# Altium schematic sheet MiniScreen.SchDoc
size D; SheetNumber: 1; SheetTotal: 1
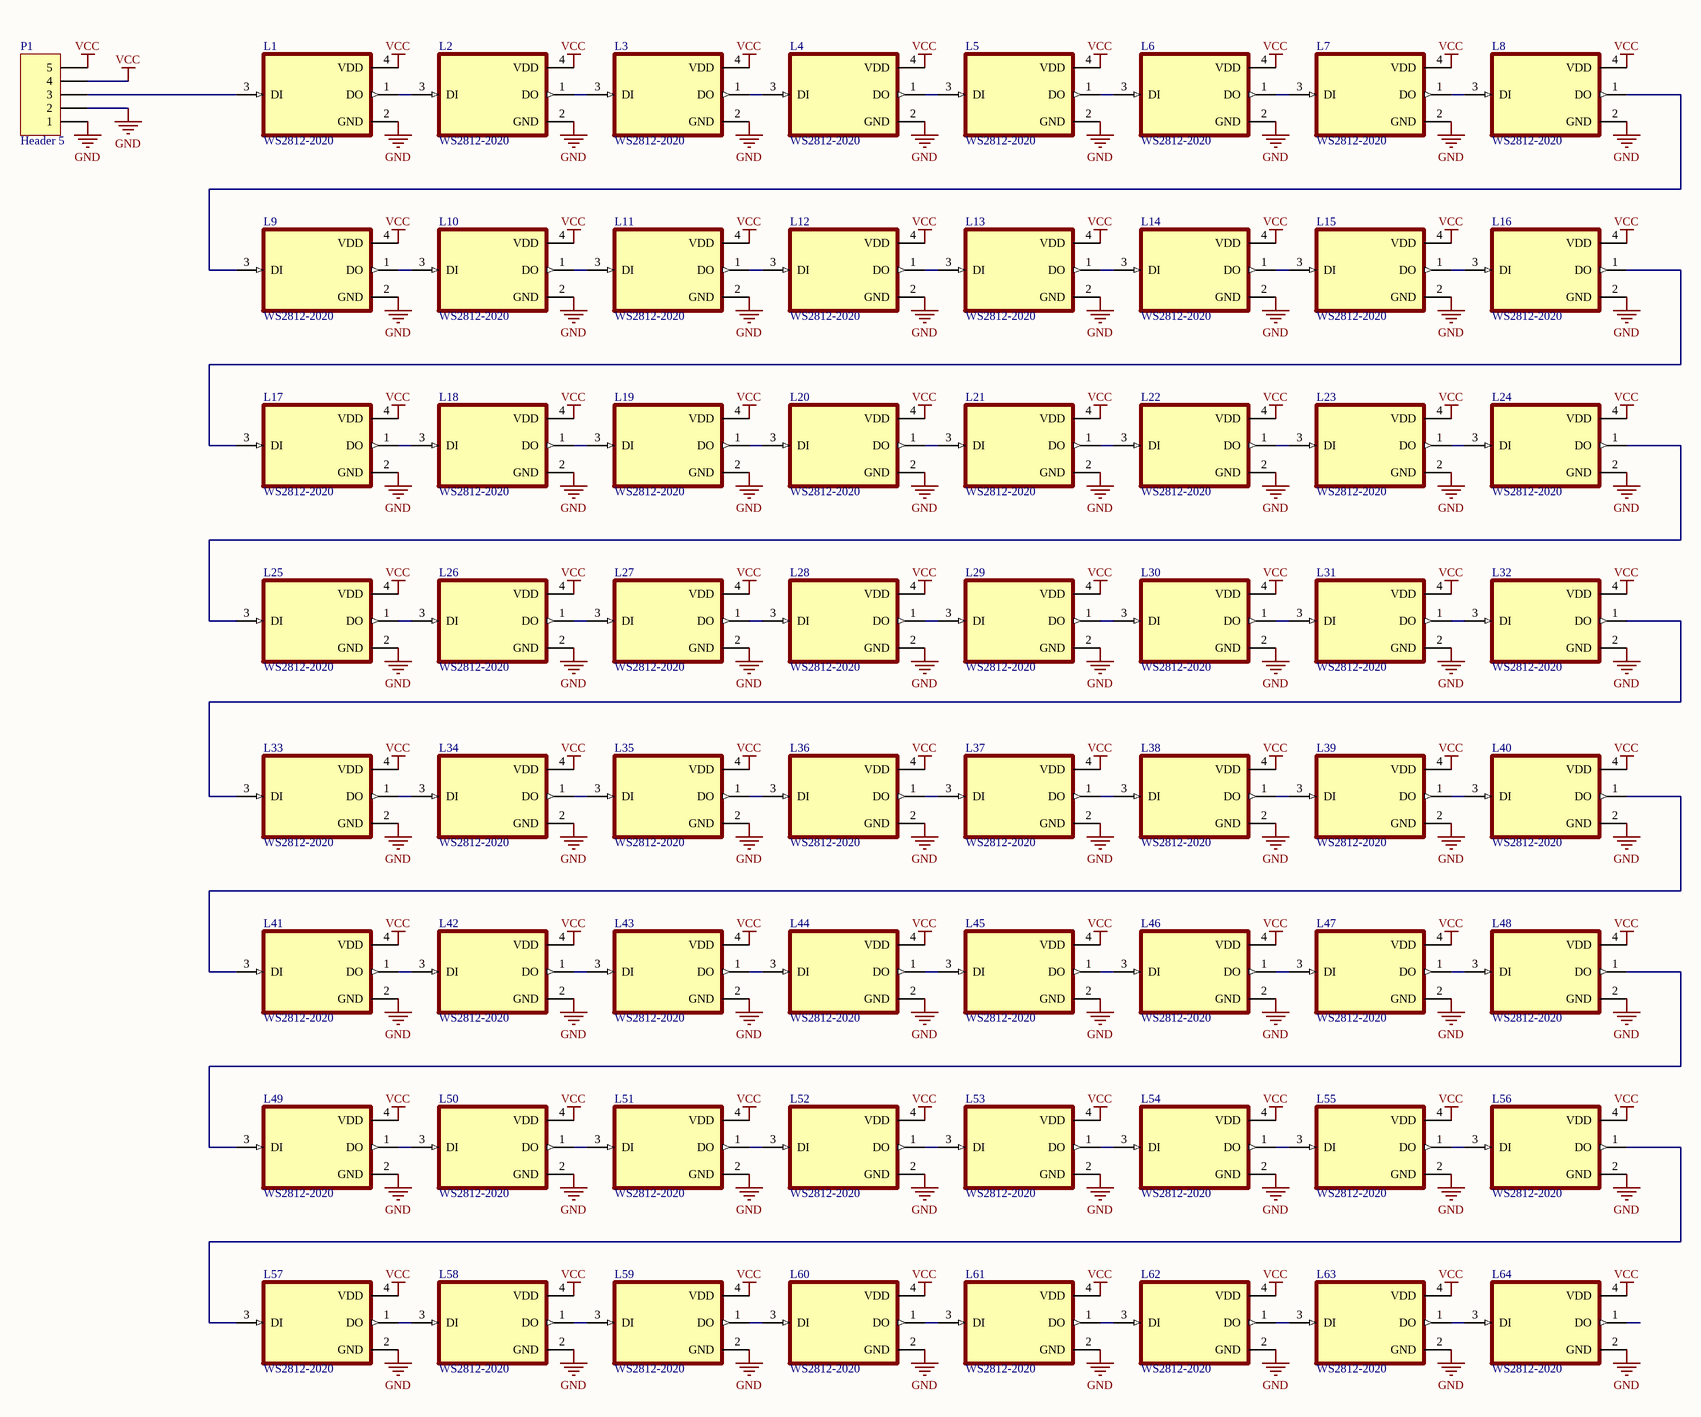
[diagram p0: MiniScreen.SchDoc]

## Parts
L1  WS2812-2020  [WS2812-2020]
L2  WS2812-2020  [WS2812-2020]
L3  WS2812-2020  [WS2812-2020]
L4  WS2812-2020  [WS2812-2020]
L5  WS2812-2020  [WS2812-2020]
L6  WS2812-2020  [WS2812-2020]
L7  WS2812-2020  [WS2812-2020]
L8  WS2812-2020  [WS2812-2020]
L9  WS2812-2020  [WS2812-2020]
L10  WS2812-2020  [WS2812-2020]
L11  WS2812-2020  [WS2812-2020]
L12  WS2812-2020  [WS2812-2020]
L13  WS2812-2020  [WS2812-2020]
L14  WS2812-2020  [WS2812-2020]
L15  WS2812-2020  [WS2812-2020]
L16  WS2812-2020  [WS2812-2020]
L17  WS2812-2020  [WS2812-2020]
L18  WS2812-2020  [WS2812-2020]
L19  WS2812-2020  [WS2812-2020]
L20  WS2812-2020  [WS2812-2020]
L21  WS2812-2020  [WS2812-2020]
L22  WS2812-2020  [WS2812-2020]
L23  WS2812-2020  [WS2812-2020]
L24  WS2812-2020  [WS2812-2020]
L25  WS2812-2020  [WS2812-2020]
L26  WS2812-2020  [WS2812-2020]
L27  WS2812-2020  [WS2812-2020]
L28  WS2812-2020  [WS2812-2020]
L29  WS2812-2020  [WS2812-2020]
L30  WS2812-2020  [WS2812-2020]
L31  WS2812-2020  [WS2812-2020]
L32  WS2812-2020  [WS2812-2020]
L33  WS2812-2020  [WS2812-2020]
L34  WS2812-2020  [WS2812-2020]
L35  WS2812-2020  [WS2812-2020]
L36  WS2812-2020  [WS2812-2020]
L37  WS2812-2020  [WS2812-2020]
L38  WS2812-2020  [WS2812-2020]
L39  WS2812-2020  [WS2812-2020]
L40  WS2812-2020  [WS2812-2020]
L41  WS2812-2020  [WS2812-2020]
L42  WS2812-2020  [WS2812-2020]
L43  WS2812-2020  [WS2812-2020]
L44  WS2812-2020  [WS2812-2020]
L45  WS2812-2020  [WS2812-2020]
L46  WS2812-2020  [WS2812-2020]
L47  WS2812-2020  [WS2812-2020]
L48  WS2812-2020  [WS2812-2020]
L49  WS2812-2020  [WS2812-2020]
L50  WS2812-2020  [WS2812-2020]
L51  WS2812-2020  [WS2812-2020]
L52  WS2812-2020  [WS2812-2020]
L53  WS2812-2020  [WS2812-2020]
L54  WS2812-2020  [WS2812-2020]
L55  WS2812-2020  [WS2812-2020]
L56  WS2812-2020  [WS2812-2020]
L57  WS2812-2020  [WS2812-2020]
L58  WS2812-2020  [WS2812-2020]
L59  WS2812-2020  [WS2812-2020]
L60  WS2812-2020  [WS2812-2020]
L61  WS2812-2020  [WS2812-2020]
L62  WS2812-2020  [WS2812-2020]
L63  WS2812-2020  [WS2812-2020]
L64  WS2812-2020  [WS2812-2020]
P1  Header 5  [HDR1X5]

## Nets
GND: L1.2(GND) L2.2(GND) L3.2(GND) L4.2(GND) L5.2(GND) L6.2(GND) L7.2(GND) L8.2(GND) L9.2(GND) L10.2(GND) L11.2(GND) L12.2(GND) L13.2(GND) L14.2(GND) L15.2(GND) L16.2(GND) L17.2(GND) L18.2(GND) L19.2(GND) L20.2(GND) L21.2(GND) L22.2(GND) L23.2(GND) L24.2(GND) L25.2(GND) L26.2(GND) L27.2(GND) L28.2(GND) L29.2(GND) L30.2(GND) L31.2(GND) L32.2(GND) L33.2(GND) L34.2(GND) L35.2(GND) L36.2(GND) L37.2(GND) L38.2(GND) L39.2(GND) L40.2(GND) L41.2(GND) L42.2(GND) L43.2(GND) L44.2(GND) L45.2(GND) L46.2(GND) L47.2(GND) L48.2(GND) L49.2(GND) L50.2(GND) L51.2(GND) L52.2(GND) L53.2(GND) L54.2(GND) L55.2(GND) L56.2(GND) L57.2(GND) L58.2(GND) L59.2(GND) L60.2(GND) L61.2(GND) L62.2(GND) L63.2(GND) L64.2(GND) P1.1 P1.2
VCC: L1.4(VDD) L2.4(VDD) L3.4(VDD) L4.4(VDD) L5.4(VDD) L6.4(VDD) L7.4(VDD) L8.4(VDD) L9.4(VDD) L10.4(VDD) L11.4(VDD) L12.4(VDD) L13.4(VDD) L14.4(VDD) L15.4(VDD) L16.4(VDD) L17.4(VDD) L18.4(VDD) L19.4(VDD) L20.4(VDD) L21.4(VDD) L22.4(VDD) L23.4(VDD) L24.4(VDD) L25.4(VDD) L26.4(VDD) L27.4(VDD) L28.4(VDD) L29.4(VDD) L30.4(VDD) L31.4(VDD) L32.4(VDD) L33.4(VDD) L34.4(VDD) L35.4(VDD) L36.4(VDD) L37.4(VDD) L38.4(VDD) L39.4(VDD) L40.4(VDD) L41.4(VDD) L42.4(VDD) L43.4(VDD) L44.4(VDD) L45.4(VDD) L46.4(VDD) L47.4(VDD) L48.4(VDD) L49.4(VDD) L50.4(VDD) L51.4(VDD) L52.4(VDD) L53.4(VDD) L54.4(VDD) L55.4(VDD) L56.4(VDD) L57.4(VDD) L58.4(VDD) L59.4(VDD) L60.4(VDD) L61.4(VDD) L62.4(VDD) L63.4(VDD) L64.4(VDD) P1.4 P1.5
NetL1_1: L1.1(DO) L2.3(DI)
NetL1_3: L1.3(DI) P1.3
NetL2_1: L2.1(DO) L3.3(DI)
NetL3_1: L3.1(DO) L4.3(DI)
NetL4_1: L4.1(DO) L5.3(DI)
NetL5_1: L5.1(DO) L6.3(DI)
NetL6_1: L6.1(DO) L7.3(DI)
NetL7_1: L7.1(DO) L8.3(DI)
NetL8_1: L8.1(DO) L9.3(DI)
NetL9_1: L9.1(DO) L10.3(DI)
NetL10_1: L10.1(DO) L11.3(DI)
NetL11_1: L11.1(DO) L12.3(DI)
NetL12_1: L12.1(DO) L13.3(DI)
NetL13_1: L13.1(DO) L14.3(DI)
NetL14_1: L14.1(DO) L15.3(DI)
NetL15_1: L15.1(DO) L16.3(DI)
NetL16_1: L16.1(DO) L17.3(DI)
NetL17_1: L17.1(DO) L18.3(DI)
NetL18_1: L18.1(DO) L19.3(DI)
NetL19_1: L19.1(DO) L20.3(DI)
NetL20_1: L20.1(DO) L21.3(DI)
NetL21_1: L21.1(DO) L22.3(DI)
NetL22_1: L22.1(DO) L23.3(DI)
NetL23_1: L23.1(DO) L24.3(DI)
NetL24_1: L24.1(DO) L25.3(DI)
NetL25_1: L25.1(DO) L26.3(DI)
NetL26_1: L26.1(DO) L27.3(DI)
NetL27_1: L27.1(DO) L28.3(DI)
NetL28_1: L28.1(DO) L29.3(DI)
NetL29_1: L29.1(DO) L30.3(DI)
NetL30_1: L30.1(DO) L31.3(DI)
NetL31_1: L31.1(DO) L32.3(DI)
NetL32_1: L32.1(DO) L33.3(DI)
NetL33_1: L33.1(DO) L34.3(DI)
NetL34_1: L34.1(DO) L35.3(DI)
NetL35_1: L35.1(DO) L36.3(DI)
NetL36_1: L36.1(DO) L37.3(DI)
NetL37_1: L37.1(DO) L38.3(DI)
NetL38_1: L38.1(DO) L39.3(DI)
NetL39_1: L39.1(DO) L40.3(DI)
NetL40_1: L40.1(DO) L41.3(DI)
NetL41_1: L41.1(DO) L42.3(DI)
NetL42_1: L42.1(DO) L43.3(DI)
NetL43_1: L43.1(DO) L44.3(DI)
NetL44_1: L44.1(DO) L45.3(DI)
NetL45_1: L45.1(DO) L46.3(DI)
NetL46_1: L46.1(DO) L47.3(DI)
NetL47_1: L47.1(DO) L48.3(DI)
NetL48_1: L48.1(DO) L49.3(DI)
NetL49_1: L49.1(DO) L50.3(DI)
NetL50_1: L50.1(DO) L51.3(DI)
NetL51_1: L51.1(DO) L52.3(DI)
NetL52_1: L52.1(DO) L53.3(DI)
NetL53_1: L53.1(DO) L54.3(DI)
NetL54_1: L54.1(DO) L55.3(DI)
NetL55_1: L55.1(DO) L56.3(DI)
NetL56_1: L56.1(DO) L57.3(DI)
NetL57_1: L57.1(DO) L58.3(DI)
NetL58_1: L58.1(DO) L59.3(DI)
NetL59_1: L59.1(DO) L60.3(DI)
NetL60_1: L60.1(DO) L61.3(DI)
NetL61_1: L61.1(DO) L62.3(DI)
NetL62_1: L62.1(DO) L63.3(DI)
NetL63_1: L63.1(DO) L64.3(DI)

Not connected (* = marked no-connect by the designer): L64 1(DO)

## Library data of the parts
L1-L64 = WS2812-2020: RGB LED; MF: {'manufacturer': u'Worldsemi'}; Value: *; Availability: Unavailable; Price: None; Package: None; MP: WS2812-2020
P1 = Header 5: Header, 5-Pin; LatestRevisionDate: 17-Jul-2002; LatestRevisionNote: Re-released for DXP Platform.; Publisher: Altium Limited